# EAGLE design Adapter_board (EAGLE 8.2.0)
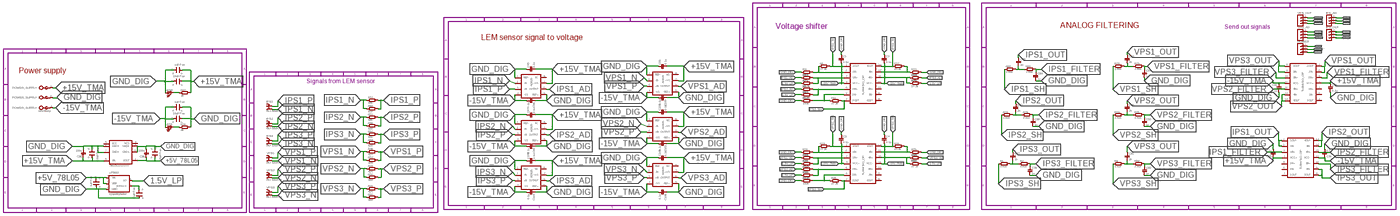
[diagram p0: schematic, sheet 1, overview]
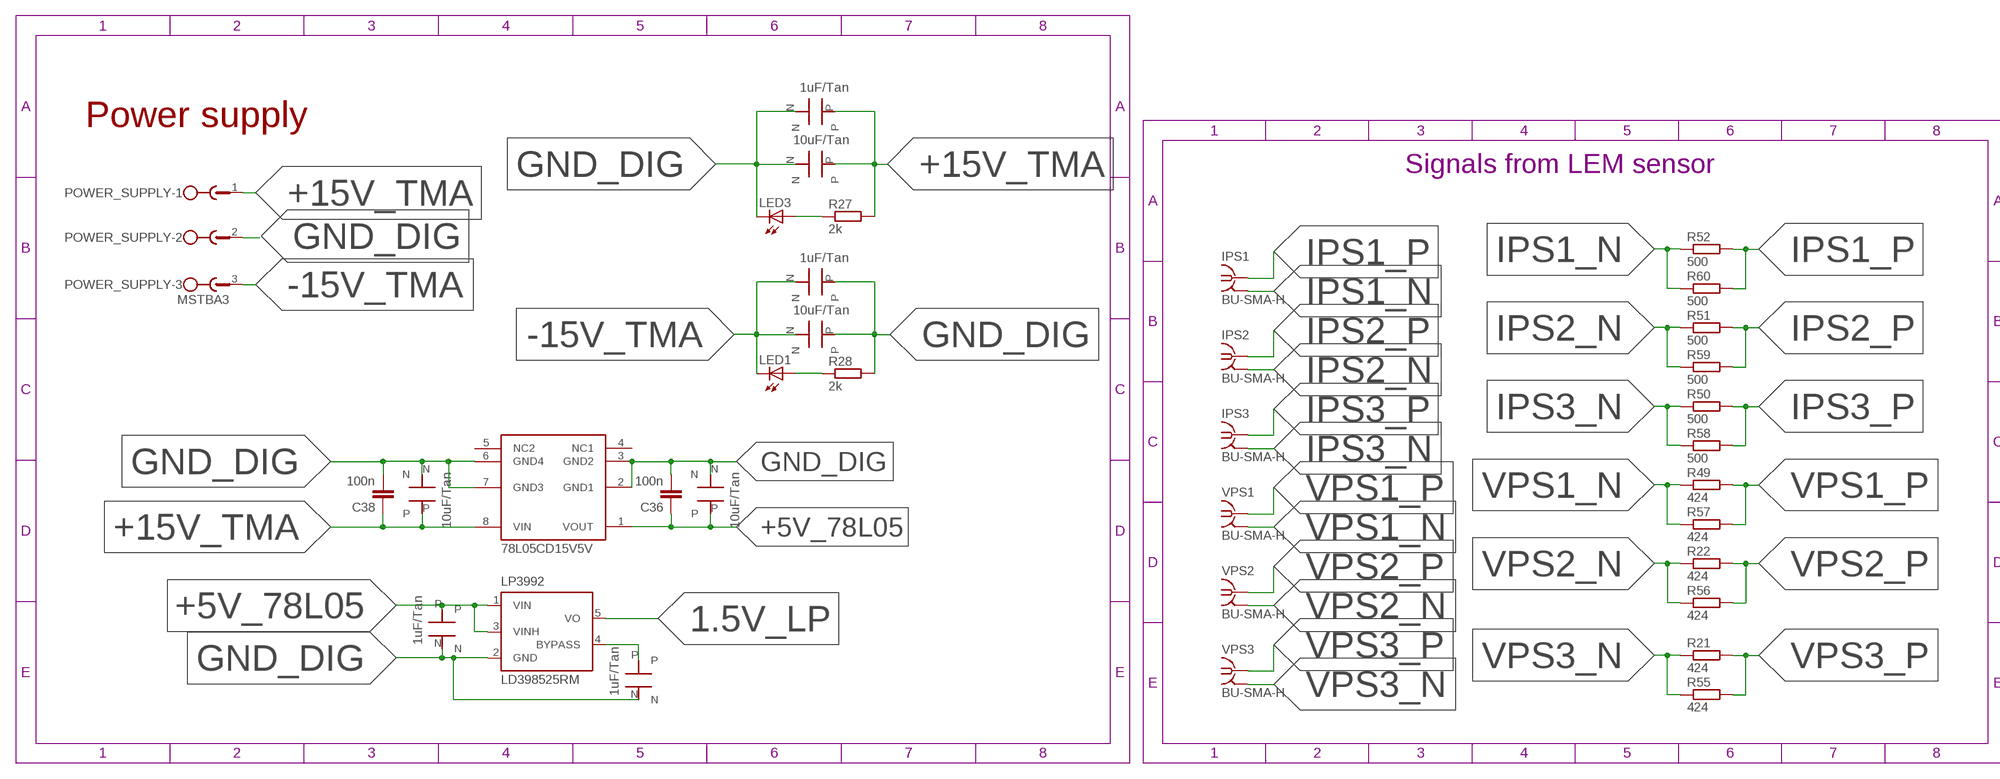
[diagram p1: schematic, sheet 1, part 1 of 4]
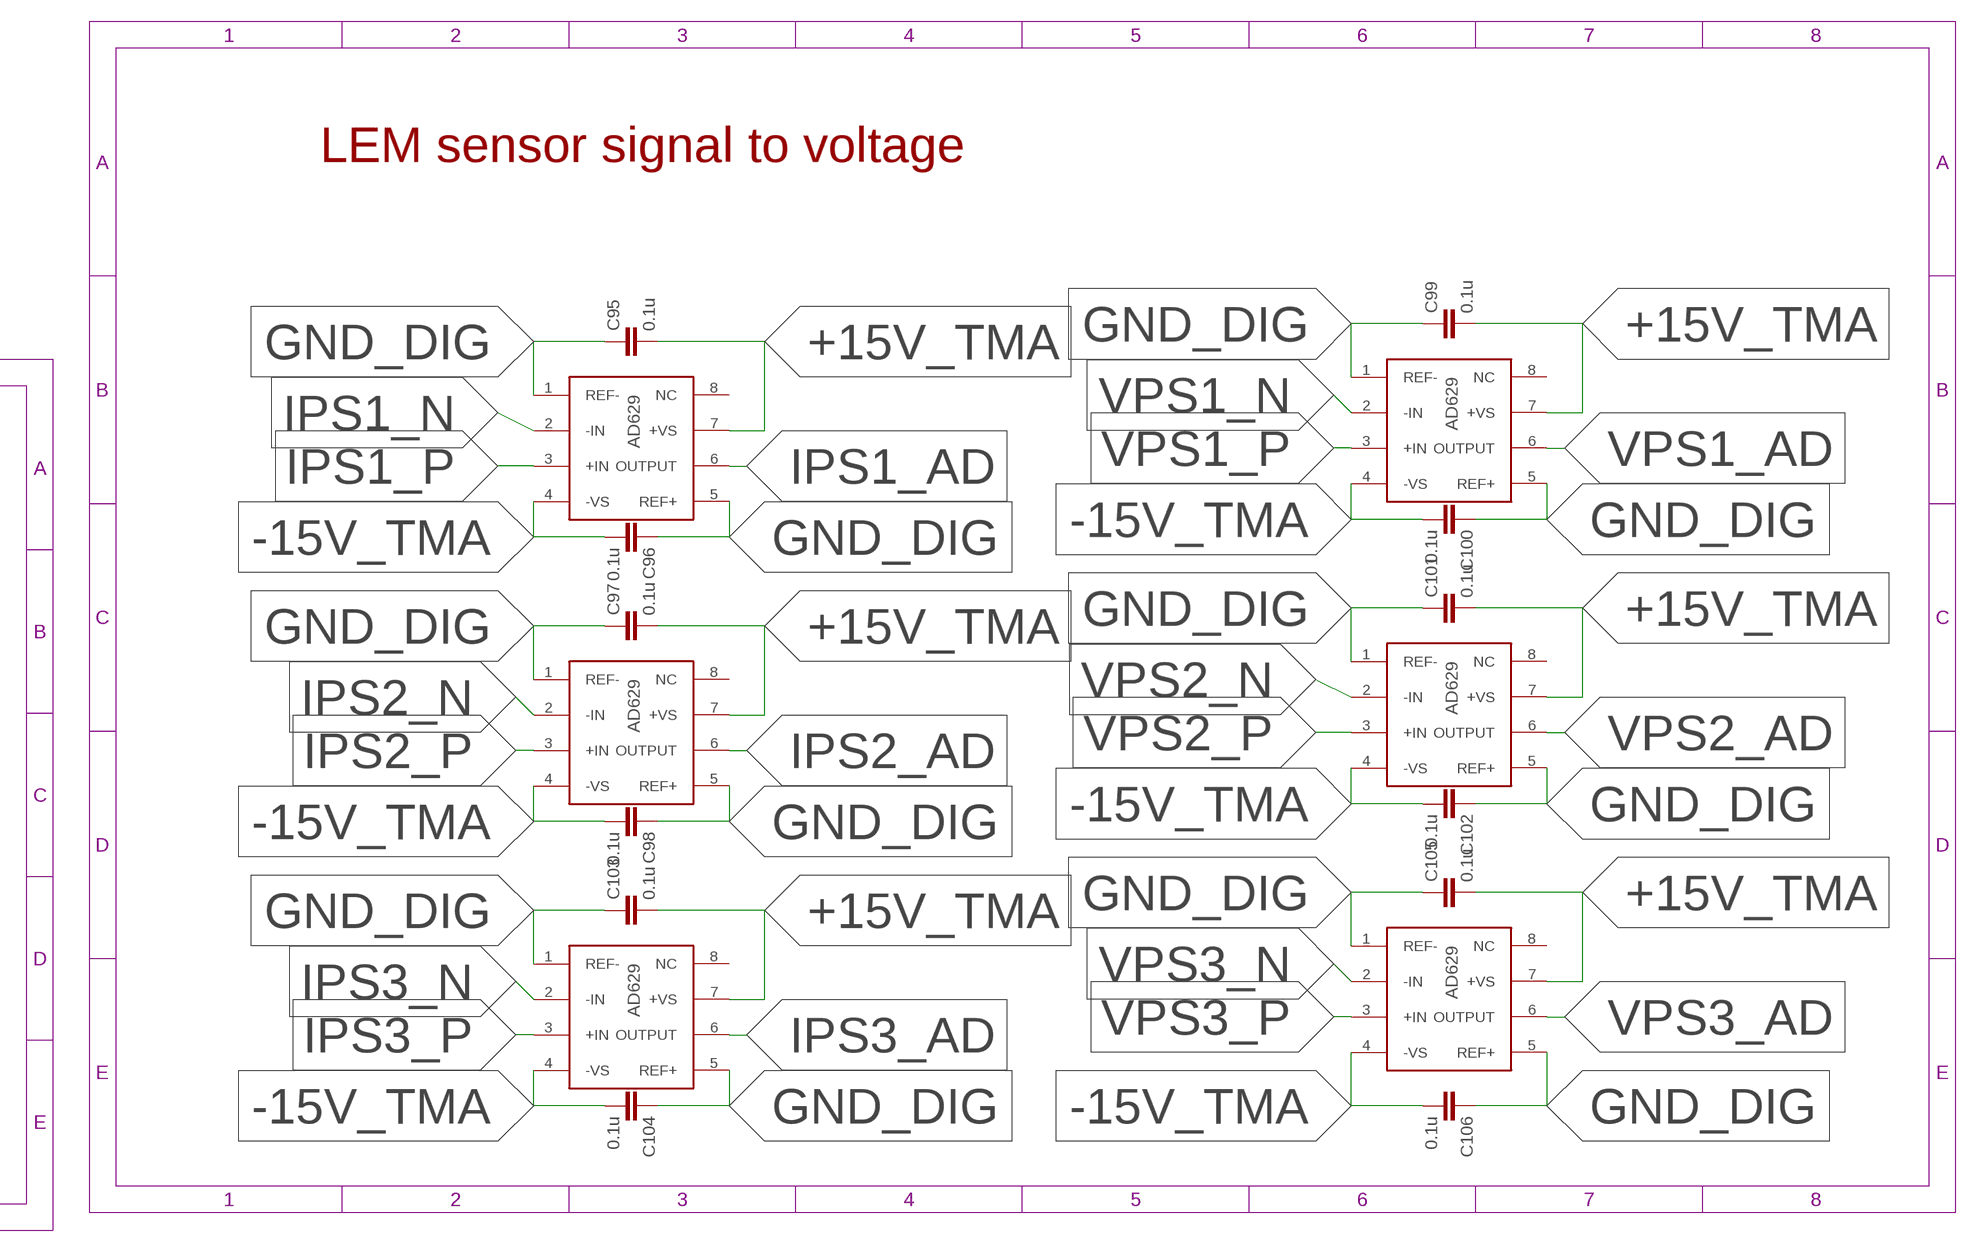
[diagram p2: schematic, sheet 1, part 2 of 4]
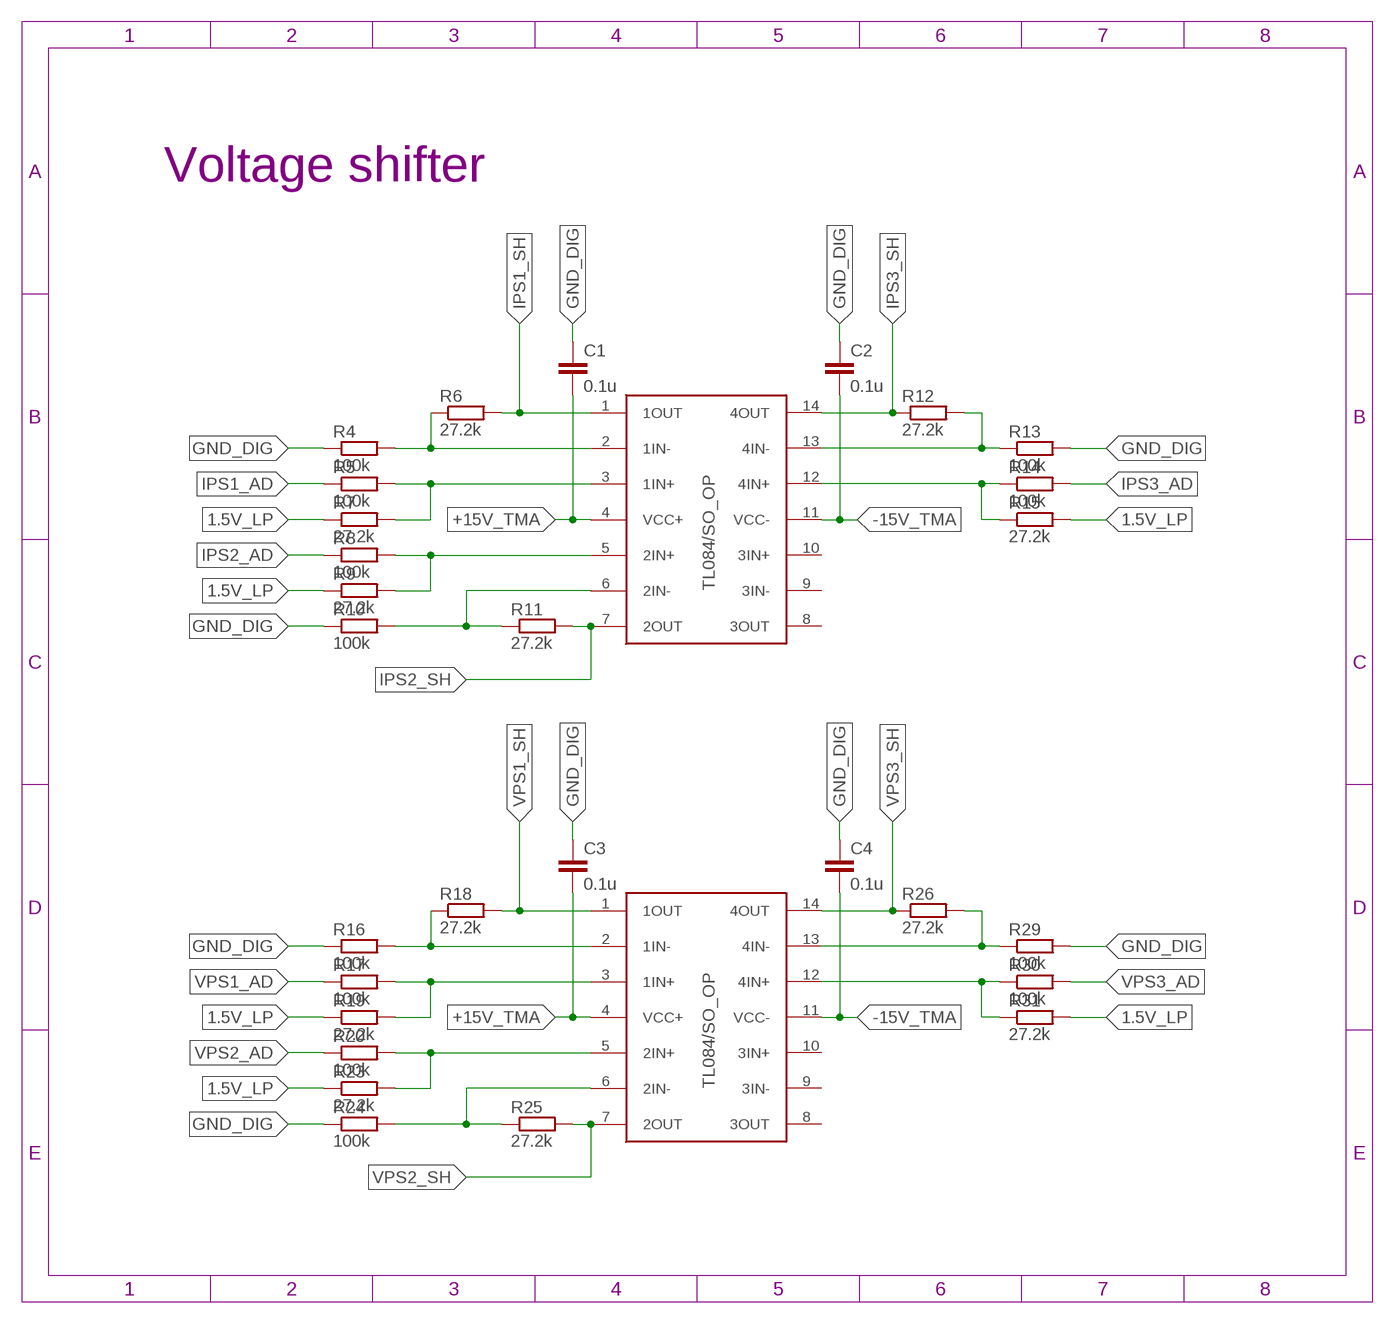
[diagram p3: schematic, sheet 1, part 3 of 4]
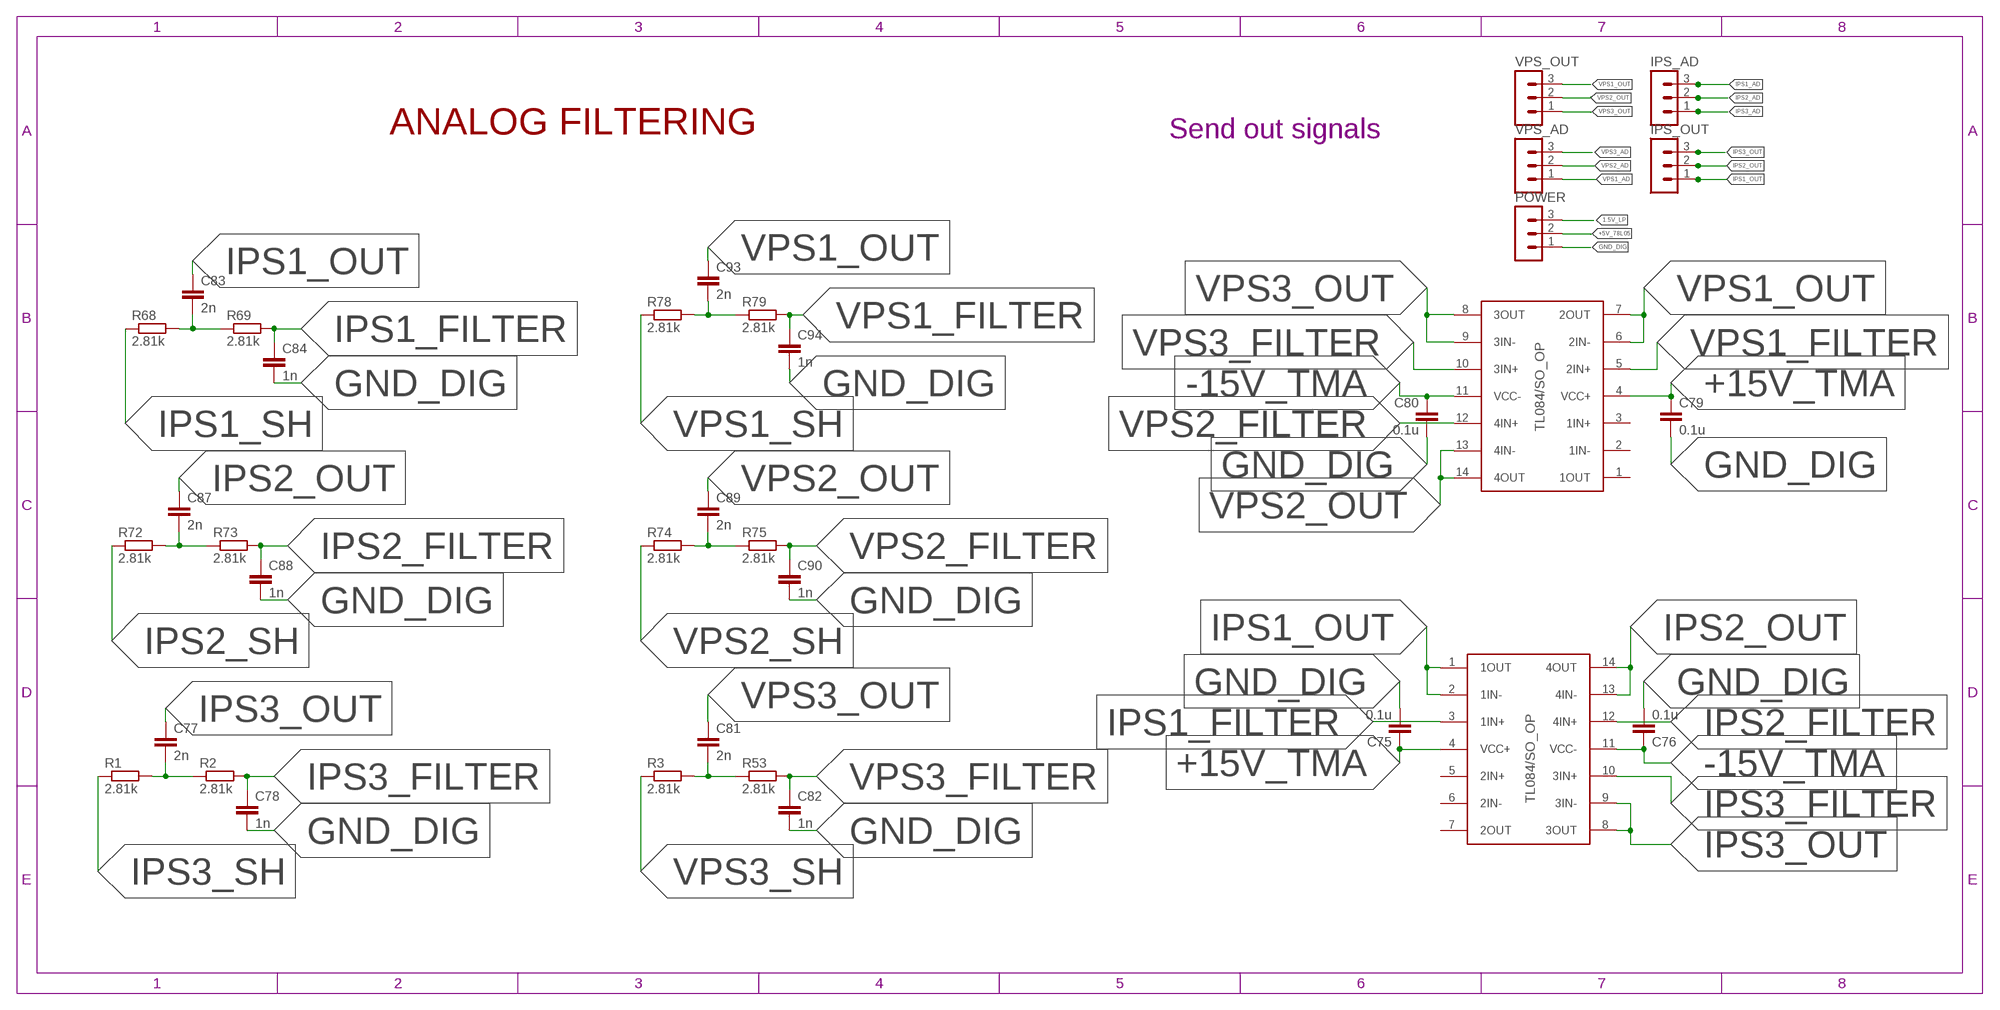
[diagram p4: schematic, sheet 1, part 4 of 4]

## Parts
78L05  78L05CD15V5VONLINE  [78L05CD15V5V_LIB]
C1  0.1u  C-EUC0805  [C0805]
C2  0.1u  C-EUC0805  [C0805]
C3  0.1u  C-EUC0805  [C0805]
C4  0.1u  C-EUC0805  [C0805]
C36  100n  C-EUC0805  [C0805]
C37  TANTALUM_C_10UF_KEM  [TANTALUM_C_10UF_KEM]
C38  100n  C-EUC0805  [C0805]
C75  0.1u  C-EUC0805  [C0805]
C76  0.1u  C-EUC0805  [C0805]
C77  2n  C-EUC0805  [C0805]
C78  1n  C-EUC0805  [C0805]
C79  0.1u  C-EUC0805  [C0805]
C80  0.1u  C-EUC0805  [C0805]
C81  2n  C-EUC0805  [C0805]
C82  1n  C-EUC0805  [C0805]
C83  2n  C-EUC0805  [C0805]
C84  1n  C-EUC0805  [C0805]
C87  2n  C-EUC0805  [C0805]
C88  1n  C-EUC0805  [C0805]
C89  2n  C-EUC0805  [C0805]
C90  1n  C-EUC0805  [C0805]
C93  2n  C-EUC0805  [C0805]
C94  1n  C-EUC0805  [C0805]
C95  0.1u  C-EUC0805  [C0805]
C96  0.1u  C-EUC0805  [C0805]
C97  0.1u  C-EUC0805  [C0805]
C98  0.1u  C-EUC0805  [C0805]
C99  0.1u  C-EUC0805  [C0805]
C100  0.1u  C-EUC0805  [C0805]
C101  0.1u  C-EUC0805  [C0805]
C102  0.1u  C-EUC0805  [C0805]
C103  0.1u  C-EUC0805  [C0805]
C104  0.1u  C-EUC0805  [C0805]
C105  0.1u  C-EUC0805  [C0805]
C106  0.1u  C-EUC0805  [C0805]
IPS1  BU-SMA-H  [BU-SMA-H]
IPS2  BU-SMA-H  [BU-SMA-H]
IPS3  BU-SMA-H  [BU-SMA-H]
IPS_AD  MA03-1  [MA03-1]
IPS_OUT  MA03-1  [MA03-1]
LED1  LEDCHIPLED_0805  [CHIPLED_0805]
LED3  LEDCHIPLED_0805  [CHIPLED_0805]
LP3992  LD398525RM  [SOT23-5L]
POWER  MA03-1  [MA03-1]
POWER_SUPPLY  MSTBA3  [MSTBA3]
R1  2.81k  R-EU_R0805  [R0805]
R2  2.81k  R-EU_R0805  [R0805]
R3  2.81k  R-EU_R0805  [R0805]
R4  100k  R-EU_R0805  [R0805]
R5  100k  R-EU_R0805  [R0805]
R6  27.2k  R-EU_R0805  [R0805]
R7  27.2k  R-EU_R0805  [R0805]
R8  100k  R-EU_R0805  [R0805]
R9  27.2k  R-EU_R0805  [R0805]
R10  100k  R-EU_R0805  [R0805]
R11  27.2k  R-EU_R0805  [R0805]
R12  27.2k  R-EU_R0805  [R0805]
R13  100k  R-EU_R0805  [R0805]
R14  100k  R-EU_R0805  [R0805]
R15  27.2k  R-EU_R0805  [R0805]
R16  100k  R-EU_R0805  [R0805]
R17  100k  R-EU_R0805  [R0805]
R18  27.2k  R-EU_R0805  [R0805]
R19  27.2k  R-EU_R0805  [R0805]
R20  100k  R-EU_R0805  [R0805]
R21  424  R-EU_R1206  [R1206]
R22  424  R-EU_R1206  [R1206]
R23  27.2k  R-EU_R0805  [R0805]
R24  100k  R-EU_R0805  [R0805]
R25  27.2k  R-EU_R0805  [R0805]
R26  27.2k  R-EU_R0805  [R0805]
R27  2k  R-EU_R0805  [R0805]
R28  2k  R-EU_R0805  [R0805]
R29  100k  R-EU_R0805  [R0805]
R30  100k  R-EU_R0805  [R0805]
R31  27.2k  R-EU_R0805  [R0805]
R49  424  R-EU_R1206  [R1206]
R50  500  R-EU_R1206  [R1206]
R51  500  R-EU_R1206  [R1206]
R52  500  R-EU_R1206  [R1206]
R53  2.81k  R-EU_R0805  [R0805]
R55  424  R-EU_R1206  [R1206]
R56  424  R-EU_R1206  [R1206]
R57  424  R-EU_R1206  [R1206]
R58  500  R-EU_R1206  [R1206]
R59  500  R-EU_R1206  [R1206]
R60  500  R-EU_R1206  [R1206]
R68  2.81k  R-EU_R0805  [R0805]
R69  2.81k  R-EU_R0805  [R0805]
R72  2.81k  R-EU_R0805  [R0805]
R73  2.81k  R-EU_R0805  [R0805]
R74  2.81k  R-EU_R0805  [R0805]
R75  2.81k  R-EU_R0805  [R0805]
R78  2.81k  R-EU_R0805  [R0805]
R79  2.81k  R-EU_R0805  [R0805]
U$1  TL084/SO_OPONLINE  [TL084/SO_OP_LIB]
U$2  TL084/SO_OPONLINE  [TL084/SO_OP_LIB]
U$3  TANTALUM_C_1UF_KEMTANTALUM_C_1UF_KEM  [TANTALUM_C_1UF_KEM]
U$4  TL084/SO_OPONLINE  [TL084/SO_OP_LIB]
U$5  TANTALUM_C_1UF_KEMTANTALUM_C_1UF_KEM  [TANTALUM_C_1UF_KEM]
U$6  TL084/SO_OPONLINE  [TL084/SO_OP_LIB]
U$10  TANTALUM_C_1UF_KEMTANTALUM_C_1UF_KEM  [TANTALUM_C_1UF_KEM]
U$11  TANTALUM_C_10UF_KEM  [TANTALUM_C_10UF_KEM]
U$12  TANTALUM_C_1UF_KEMTANTALUM_C_1UF_KEM  [TANTALUM_C_1UF_KEM]
U$14  TANTALUM_C_10UF_KEM  [TANTALUM_C_10UF_KEM]
U$24  AD629_DIFFAONLINE  [AD629_DIFFA_LIB]
U$27  AD629_DIFFAONLINE  [AD629_DIFFA_LIB]
U$28  AD629_DIFFAONLINE  [AD629_DIFFA_LIB]
U$29  AD629_DIFFAONLINE  [AD629_DIFFA_LIB]
U$30  AD629_DIFFAONLINE  [AD629_DIFFA_LIB]
U$31  AD629_DIFFAONLINE  [AD629_DIFFA_LIB]
U$66  TANTALUM_C_10UF_KEM  [TANTALUM_C_10UF_KEM]
VPS1  BU-SMA-H  [BU-SMA-H]
VPS2  BU-SMA-H  [BU-SMA-H]
VPS3  BU-SMA-H  [BU-SMA-H]
VPS_AD  MA03-1  [MA03-1]
VPS_OUT  MA03-1  [MA03-1]

## Nets
1.5V_LP: LP3992.5(VO) POWER.3 R7.1 R9.1 R15.2 R19.1 R23.1 R31.2
+5V_78L05: 78L05.1(VOUT) C36.1 C37.P LP3992.1(VIN) LP3992.3(VINH) POWER.2 U$3.P
+15V_TMA: 78L05.8(VIN) C1.2 C3.2 C38.1 C75.1 C79.1 C95.2 C97.2 C99.2 C101.2 C103.2 C105.2 POWER_SUPPLY.1 R27.2 U$1.4(VCC+) U$2.4(VCC+) U$4.4(VCC+) U$6.4(VCC+) U$10.P U$11.P U$24.7(+VS) U$27.7(+VS) U$28.7(+VS) U$29.7(+VS) U$30.7(+VS) U$31.7(+VS) U$66.P
-15V_TMA: C2.2 C4.2 C76.1 C80.1 C96.2 C98.2 C100.2 C102.2 C104.2 C106.2 LED1.C POWER_SUPPLY.3 U$1.11(VCC-) U$2.11(VCC-) U$4.11(VCC-) U$6.11(VCC-) U$12.N U$14.N U$24.4(-VS) U$27.4(-VS) U$28.4(-VS) U$29.4(-VS) U$30.4(-VS) U$31.4(-VS)
GND_DIG: 78L05.2(GND1) 78L05.3(GND2) 78L05.6(GND4) 78L05.7(GND3) C1.1 C2.1 C3.1 C4.1 C36.2 C37.N C38.2 C75.2 C76.2 C78.2 C79.2 C80.2 C82.2 C84.2 C88.2 C90.2 C94.2 C95.1 C96.1 C97.1 C98.1 C99.1 C100.1 C101.1 C102.1 C103.1 C104.1 C105.1 C106.1 LED3.C LP3992.2(GND) POWER.1 POWER_SUPPLY.2 R4.1 R10.1 R13.2 R16.1 R24.1 R28.2 R29.2 U$3.N U$5.N U$10.N U$11.N U$12.P U$14.P U$24.1(REF-) U$24.5(REF+) U$27.1(REF-) U$27.5(REF+) U$28.1(REF-) U$28.5(REF+) U$29.1(REF-) U$29.5(REF+) U$30.1(REF-) U$30.5(REF+) U$31.1(REF-) U$31.5(REF+) U$66.N
IPS1_AD: IPS_AD.3 R5.1 U$24.6(OUTPUT)
IPS1_FILTER: C84.1 R69.2 U$4.3(1IN+)
IPS1_N: IPS1.2 IPS1.3 IPS1.4 IPS1.5 R52.1 R60.1 U$24.2(-IN)
IPS1_OUT: C83.1 IPS_OUT.1 U$4.1(1OUT) U$4.2(1IN-)
IPS1_P: IPS1.1 R52.2 R60.2 U$24.3(+IN)
IPS1_SH: R6.2 R68.1 U$1.1(1OUT)
IPS2_AD: IPS_AD.2 R8.1 U$27.6(OUTPUT)
IPS2_FILTER: C88.1 R73.2 U$4.12(4IN+)
IPS2_N: IPS2.2 IPS2.3 IPS2.4 IPS2.5 R51.1 R59.1 U$27.2(-IN)
IPS2_OUT: C87.1 IPS_OUT.2 U$4.13(4IN-) U$4.14(4OUT)
IPS2_P: IPS2.1 R51.2 R59.2 U$27.3(+IN)
IPS2_SH: R11.2 R72.1 U$1.7(2OUT)
IPS3_AD: IPS_AD.1 R14.2 U$30.6(OUTPUT)
IPS3_FILTER: C78.1 R2.2 U$4.10(3IN+)
IPS3_N: IPS3.2 IPS3.3 IPS3.4 IPS3.5 R50.1 R58.1 U$30.2(-IN)
IPS3_OUT: C77.1 IPS_OUT.3 U$4.8(3OUT) U$4.9(3IN-)
IPS3_P: IPS3.1 R50.2 R58.2 U$30.3(+IN)
IPS3_SH: R1.1 R12.1 U$1.14(4OUT)
N$2: LP3992.4(BYPASS) U$5.P
N$3: R4.2 R6.1 U$1.2(1IN-)
N$4: R5.2 R7.2 U$1.3(1IN+)
N$5: R16.2 R18.1 U$2.2(1IN-)
N$6: R10.2 R11.1 U$1.6(2IN-)
N$7: R8.2 R9.2 U$1.5(2IN+)
N$8: R17.2 R19.2 U$2.3(1IN+)
N$9: C77.2 R1.2 R2.1
N$10: C81.2 R3.2 R53.1
N$11: C83.2 R68.2 R69.1
N$12: LED3.A R27.1
N$14: LED1.A R28.1
N$15: C87.2 R72.2 R73.1
N$16: R20.2 R23.2 U$2.5(2IN+)
N$17: C89.2 R74.2 R75.1
N$19: C93.2 R78.2 R79.1
N$20: R12.2 R13.1 U$1.13(4IN-)
N$21: R14.1 R15.1 U$1.12(4IN+)
N$22: R24.2 R25.1 U$2.6(2IN-)
N$23: R26.2 R29.1 U$2.13(4IN-)
N$24: R30.1 R31.1 U$2.12(4IN+)
VPS1_AD: R17.1 U$28.6(OUTPUT) VPS_AD.1
VPS1_FILTER: C94.1 R79.2 U$6.5(2IN+)
VPS1_N: R49.1 R57.1 U$28.2(-IN) VPS1.2 VPS1.3 VPS1.4 VPS1.5
VPS1_OUT: C93.1 U$6.6(2IN-) U$6.7(2OUT) VPS_OUT.3
VPS1_P: R49.2 R57.2 U$28.3(+IN) VPS1.1
VPS1_SH: R18.2 R78.1 U$2.1(1OUT)
VPS2_AD: R20.1 U$29.6(OUTPUT) VPS_AD.2
VPS2_FILTER: C90.1 R75.2 U$6.12(4IN+)
VPS2_N: R22.1 R56.1 U$29.2(-IN) VPS2.2 VPS2.3 VPS2.4 VPS2.5
VPS2_OUT: C89.1 U$6.13(4IN-) U$6.14(4OUT) VPS_OUT.2
VPS2_P: R22.2 R56.2 U$29.3(+IN) VPS2.1
VPS2_SH: R25.2 R74.1 U$2.7(2OUT)
VPS3_AD: R30.2 U$31.6(OUTPUT) VPS_AD.3
VPS3_FILTER: C82.1 R53.2 U$6.10(3IN+)
VPS3_N: R21.1 R55.1 U$31.2(-IN) VPS3.2 VPS3.3 VPS3.4 VPS3.5
VPS3_OUT: C81.1 U$6.8(3OUT) U$6.9(3IN-) VPS_OUT.1
VPS3_P: R21.2 R55.2 U$31.3(+IN) VPS3.1
VPS3_SH: R3.1 R26.1 U$2.14(4OUT)
Unconnected: 78L05.4(NC1) 78L05.5(NC2) U$1.8(3OUT) U$1.9(3IN-) U$1.10(3IN+) U$2.8(3OUT) U$2.9(3IN-) U$2.10(3IN+) U$4.5(2IN+) U$4.6(2IN-) U$4.7(2OUT) U$6.1(1OUT) U$6.2(1IN-) U$6.3(1IN+) U$24.8(NC) U$27.8(NC) U$28.8(NC) U$29.8(NC) U$30.8(NC) U$31.8(NC)

## Notes on the sheet
- Voltage shifter | ANALOG FILTERING | Send out signals
- LEM sensor signal to voltage
- Power supply
- Signals from LEM sensor

## Library data of the parts
78L05 = Submodule:78L05CD15V5V: 78L05CD 15 V- 5 V voltage regulator
C1-C4 C36 C38 C75-C84 C87-C90 C93-C106 = rcl:C-EU: CAPACITOR, European symbol
C37 U$11 U$14 U$66 = Submodule:TANTALUM_C_10UF_KEM
IPS1-IPS3 VPS1-VPS3 = con-coax:BU-SMA-H: FEMALE SMA CONNECTOR Radiall; OC_FARNELL: unknown; OC_NEWARK: unknown
IPS_AD IPS_OUT POWER VPS_AD VPS_OUT = con-lstb:MA03-1: PIN HEADER; OC_FARNELL: unknown; OC_NEWARK: unknown
LED1 LED3 = led:LED: LED OSRAM: - CHIPLED LG R971, LG N971, LY N971, LG Q971, LY Q971, LO R971, LY R971 LH N974, LH R974 LS Q976, LO Q976, LY Q976 LO Q996 - Hyper CHIPLED LW Q18S LB Q993, LB Q99A, LB R99A - SideLED LS A670, LO A670, LY A670, LG A670, LP A670 LB A673, LV A673, LT A673, LW A673 LH A674 LY A675 LS A676, LA A676, LO A676, LY A676, LW A676 LS A679, LY A679, LG A679 - Hyper Micro SIDELED® LS Y876, LA Y876, LO Y876, LY Y876 LT Y87S - SmartLED LW L88C, LW L88S LB L89C, LB L89S, LG L890 LS L89K, LO L89K, LY L89K LS L896, LA L896, LO L896, LY L896 - TOPLED LS T670, LO T670, LY T670, LG T670, LP T670 LSG T670, LSP T670, LSY T670, LOP T670, LYG T670 LG T671, LOG T671, LSG T671 LB T673, LV T673, LT T673, LW T673 LH T674 LS T676, LA T676, LO T676, LY T676, LB T676, LH T676, LSB T676, LW T676 LB T67C, LV T67C, LT T67C, LS T67K, LO T67K, LY T67K, LW E67C LS E67B, LA E67B, LO E67B, LY E67B, LB E67C, LV E67C, LT E67C LW T67C LS T679, LY T679, LG T679 LS T770, LO T770, LY T770, LG T770, LP T770 LB T773, LV T773, LT T773, LW T773 LH T774 LS E675, LA E675, LY E675, LS T675 LS T776, LA T776, LO T776, LY T776, LB T776 LHGB T686 LT T68C, LB T68C - Hyper Mini TOPLED® LB M676 - Mini TOPLED Santana® LG M470 LS M47K, LO M47K, LY M47K Source: http://www.osram.convergy.de LUXEON: - LUMILED® LXK2-PW12-R00, LXK2-PW12-S00, LXK2-PW14-U00, LXK2-PW14-V00 LXK2-PM12-R00, LXK2-PM12-S00, LXK2-PM14-U00 LXK2-PE12-Q00, LXK2-PE12-R00, LXK2-PE12-S00, LXK2-PE14-T00, LXK2-PE14-U00 LXK2-PB12-K00, LXK2-PB12-L00, LXK2-PB12-M00, LXK2-PB14-N00, LXK2-PB14-P00, LXK2-PB14-Q00 LXK2-PR12-L00, LXK2-PR12-M00, LXK2-PR14-Q00, LXK2-PR14-R00 LXK2-PD12-Q00, LXK2-PD12-R00, LXK2-PD12-S00 LXK2-PH12-R00, LXK2-PH12-S00 LXK2-PL12-P00, LXK2-PL12-Q00, LXK2-PL12-R00 Source: www.luxeon.com KINGBRIGHT: KA-3528ASYC Source: www.kingbright.com
LP3992 = st-microelectronics:LD3985: Ultra low drop and low noise BiCMOS voltage regulators Source: www.st.com LD3985.pdf
POWER_SUPPLY = con-phoenix-508:MSTBA3: PHOENIX; MF: FARNELL; MPN: 1757255; OC_FARNELL: 3705183; OC_NEWARK: 71C4162
R1-R31 R49-R53 R55-R60 R68 R69 R72-R75 R78 R79 = rcl:R-EU_: RESISTOR, European symbol
U$1 U$2 U$4 U$6 = Submodule:TL084/SO_OP
U$3 U$5 U$10 U$12 = Submodule:TANTALUM_C_1UF_KEM
U$24 U$27-U$31 = Submodule:AD629_DIFFA

## Board
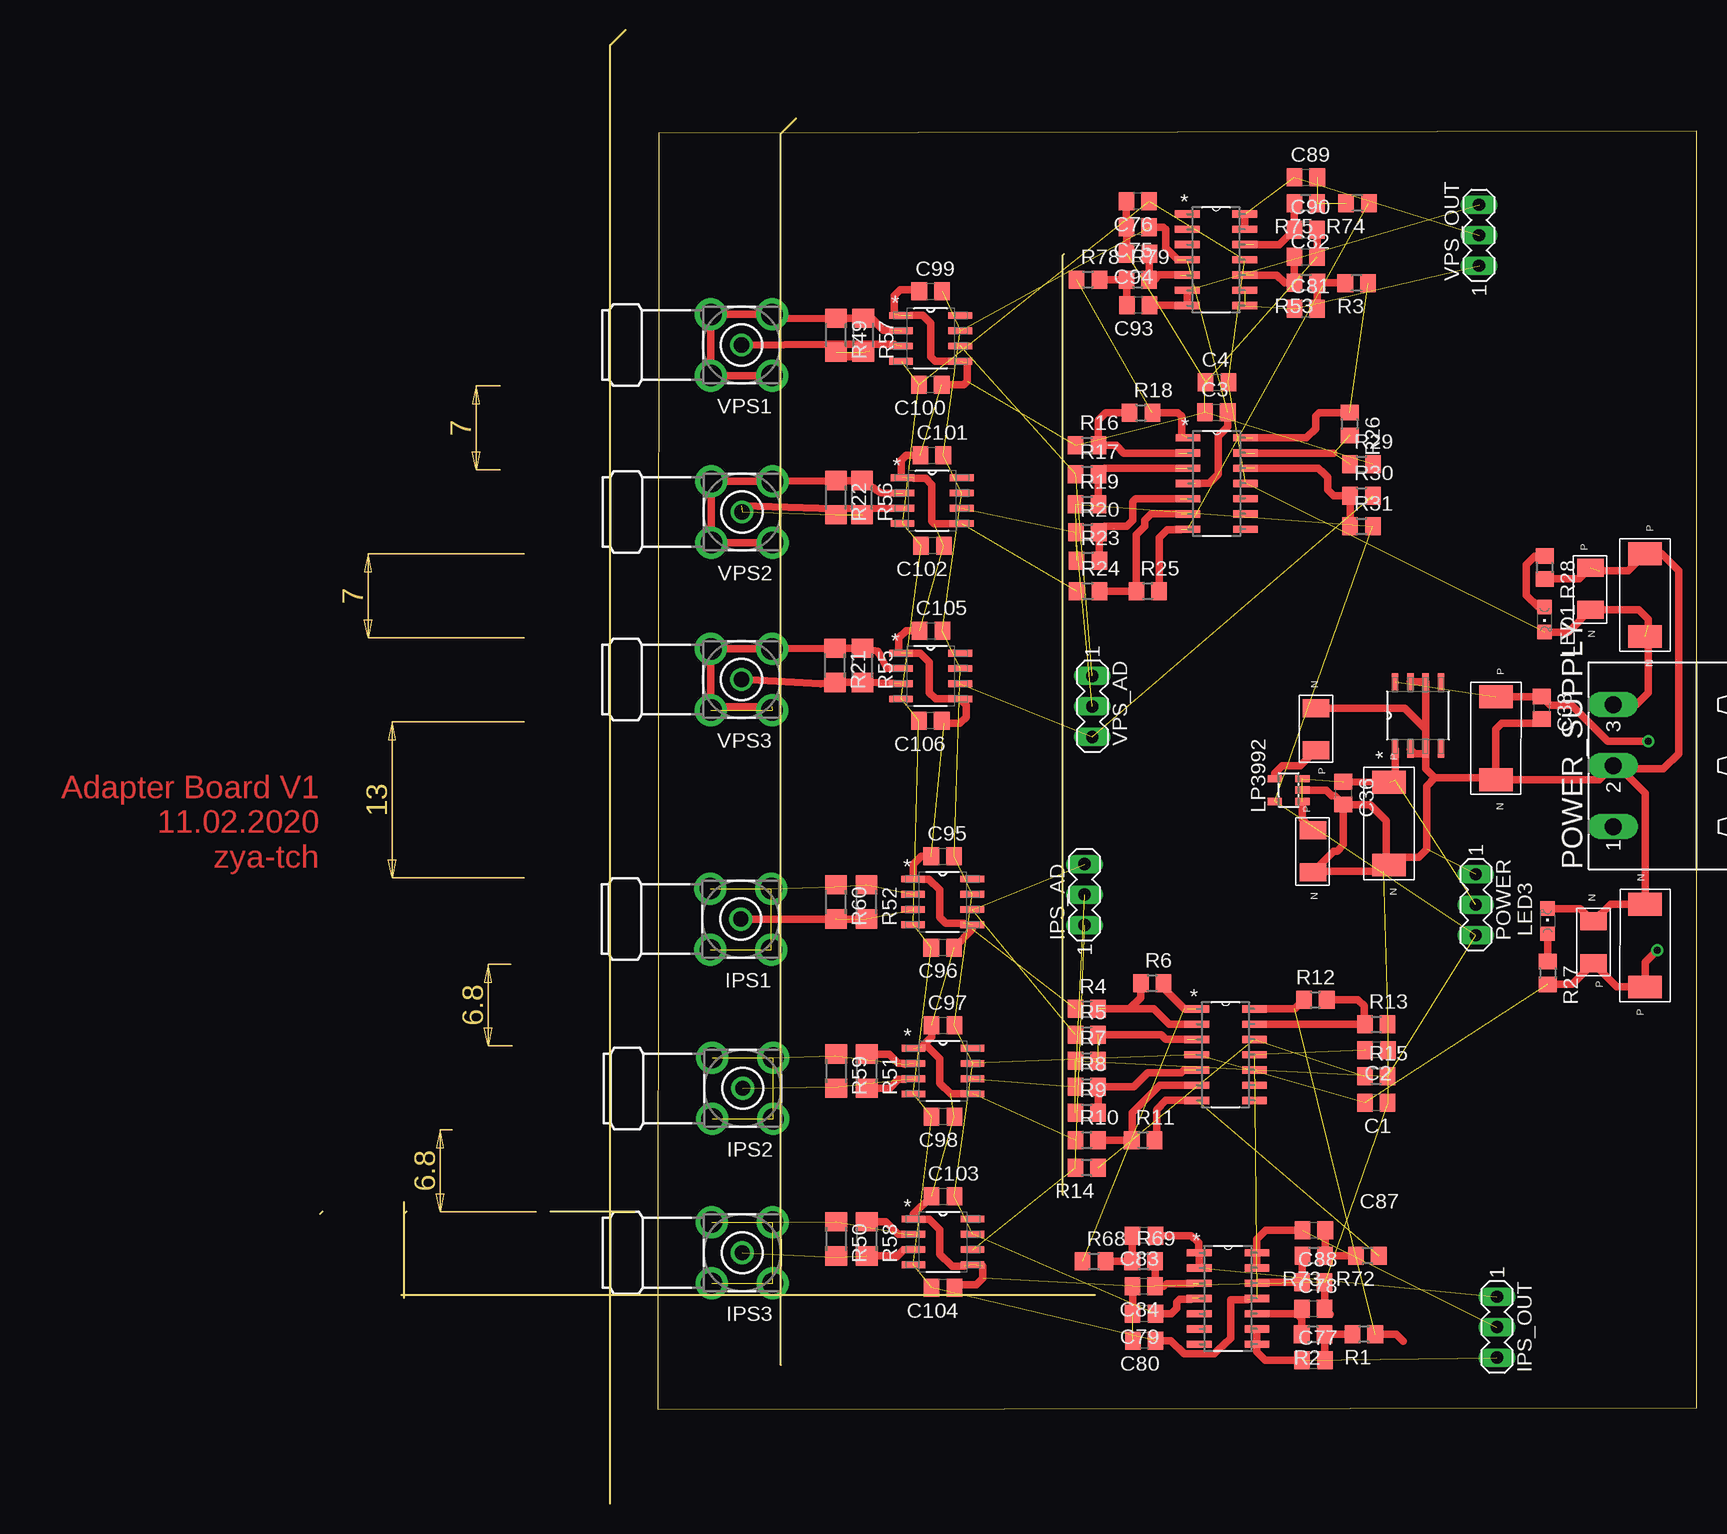
[diagram p5: board, top side]
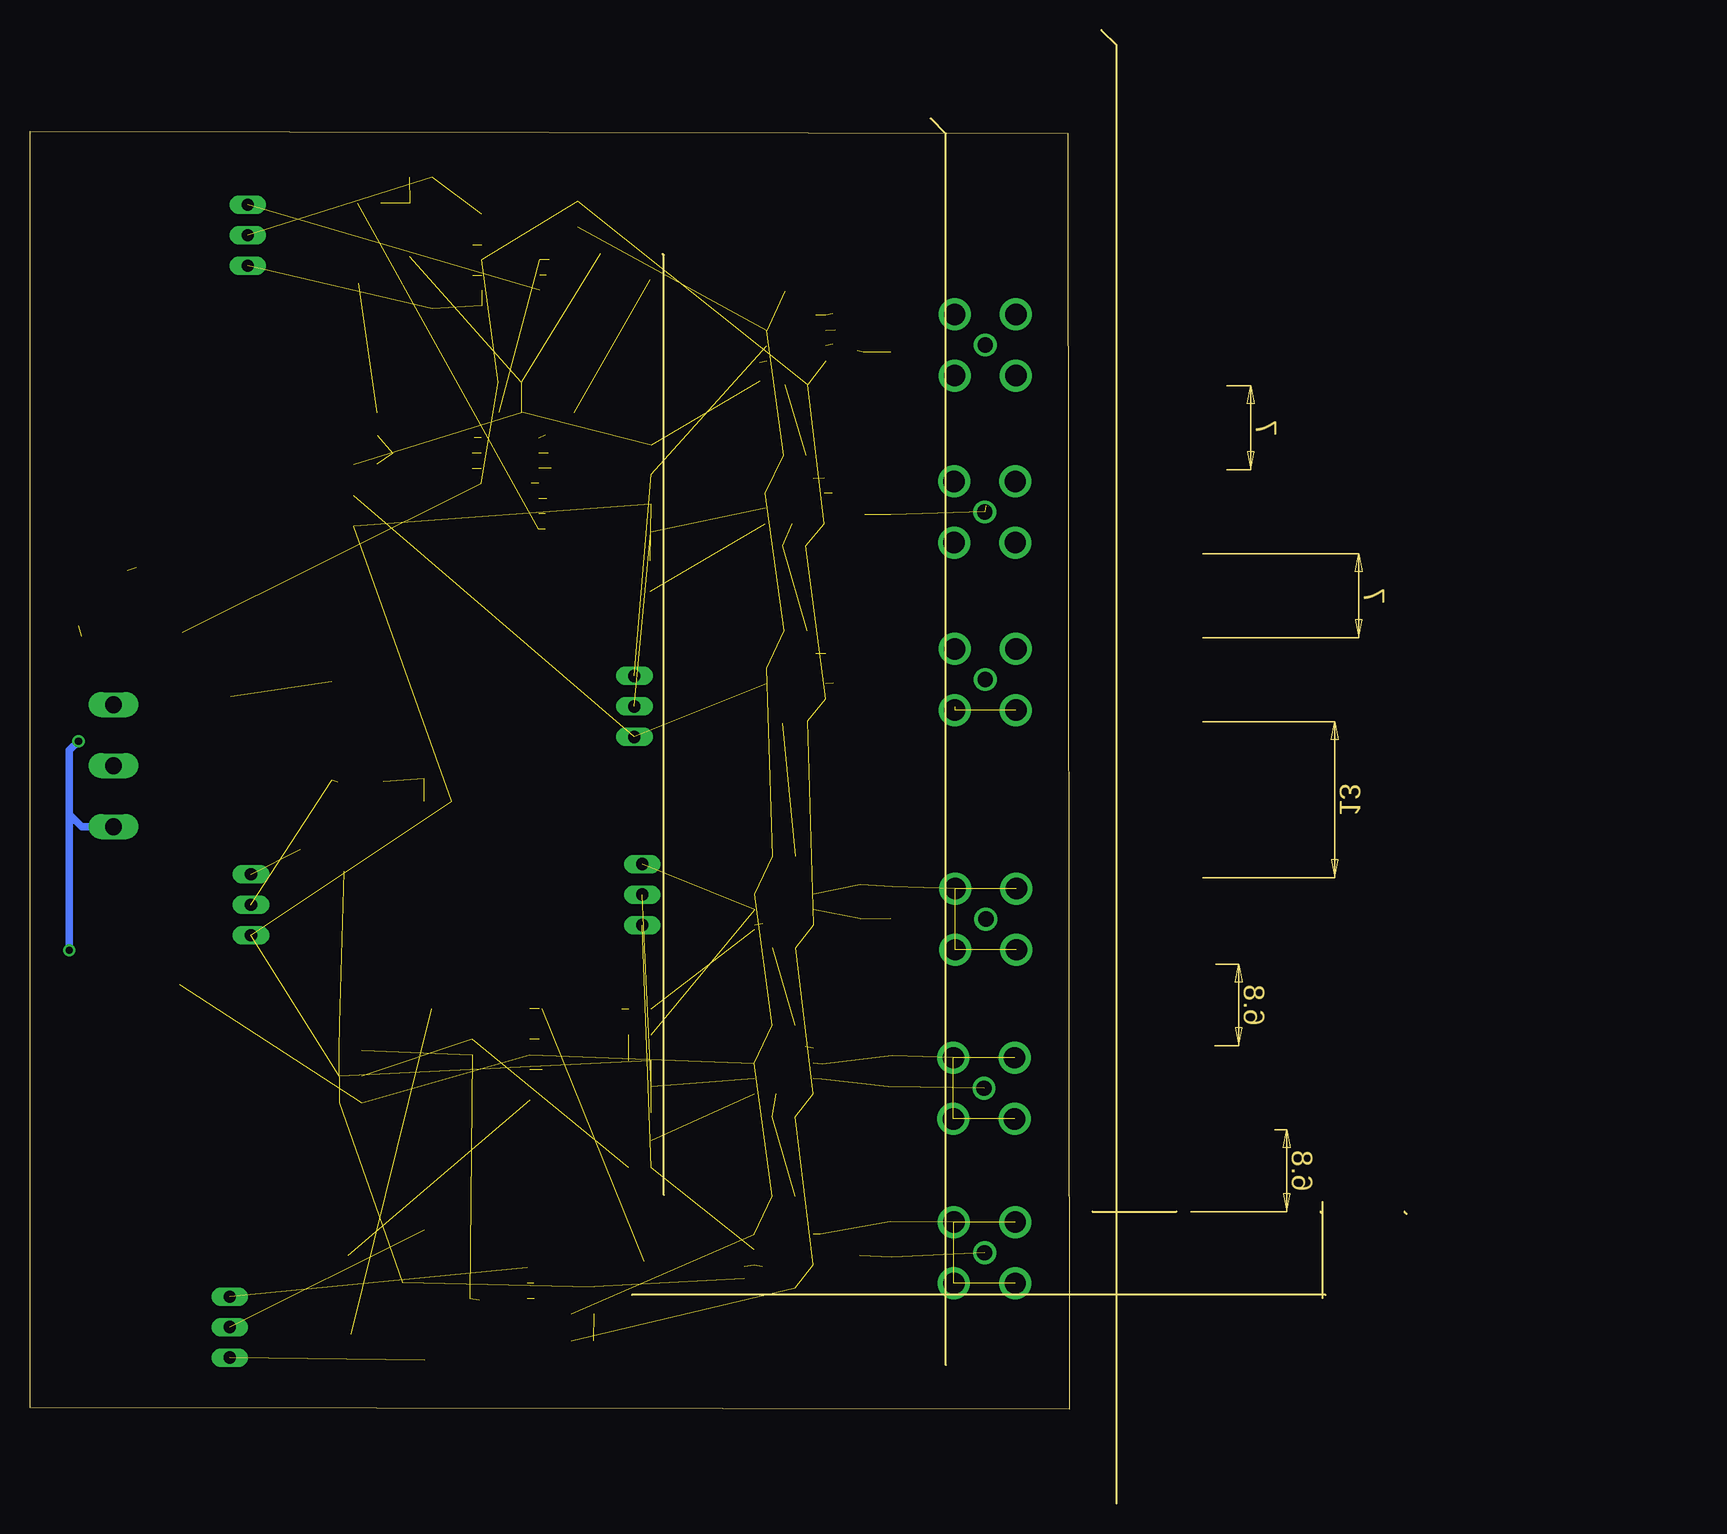
[diagram p6: board, bottom side, seen from below]

Size 114.72 x 122.81 mm. Coordinates in mm from the lower left corner, seen from the top.
Outline: 38.4,11.56 38.4,114.17 39.67,115.44
Outline: 24.17,0 24.17,121.54 25.44,122.81
Outline: 6.77,17.4 64.56,17.4
Outline: 7.2,24.34 7,24.14
Outline: 7,17.14 7,25.14
Outline: 0.2,24.34 0,24.14
Outline: 26.2,24.34 19.2,24.34
Outline: 61.9,25.74 61.9,104.04 62,104.14
Outline: 28.13,7.89 114.72,8.02 114.72,114.35 28.23,114.23 28.13,7.89
Copper layers (1*16): Top 0.035mm / dielectric 1.5mm / Bottom 0.035mm
Design rules "default *": minimum track width 10mil, minimum drill 24mil, track to track 8mil, track to pad 8mil, pad to pad 8mil, via to via 8mil, smd to smd 8mil, copper to edge 40mil, drill to drill 8mil, minimum pad ring 10mil, minimum via ring 8mil, stop-mask expansion 4mil, vias tented up to drill 0mil, thermal gap 10mil

### Footprints (pad centres in the part's own frame; a part is rotated, then mirrored left to right if it is on the bottom)
78L05CD15V5V_LIB = smd 1.422 x 0.533: 1 -2.927,1.787; 2 -2.927,0.517; 3 -2.927,-0.753; 4 -2.927,-2.023; 5 2.661,-2.023; 6 2.661,-0.753; 7 2.661,0.517; 8 2.661,1.787
C0805 = smd 1.3 x 1.5: 1 -0.95,0; 2 0.95,0
TANTALUM_C_10UF_KEM = smd 1.9 x 2.8: N 3.45,0; P -3.45,0
BU-SMA-H = drill 1.27: 1 0,0 | drill 1.778: 2 -2.55,2.55; 3 2.55,2.55; 4 2.55,-2.55; 5 -2.55,-2.55
MA03-1 = drill 1.016 long: 1 -2.54,0; 2 0,0; 3 2.54,0
CHIPLED_0805 = smd 1.2 x 1.2: A 0,-1.05; C 0,1.05
SOT23-5L = smd 0.6 x 1.2: 1 -0.95,-1.15; 2 0,-1.15; 3 0.95,-1.15; 4 0.95,1.15; 5 -0.95,1.15
MSTBA3 = drill 1.397 long: 1 -5.08,5.08; 2 0,5.08; 3 5.08,5.08
R0805 = smd 1.3 x 1.5: 1 -0.95,0; 2 0.95,0
R1206 = smd 1.6 x 1.803: 1 -1.422,0; 2 1.422,0
TL084/SO_OP_LIB = smd 2.057 x 0.61: 1 -2.261,3.81; 2 -2.261,2.54; 3 -2.261,1.27; 4 -2.261,0; 5 -2.261,-1.27; 6 -2.261,-2.54; 7 -2.261,-3.81; 8 2.54,-3.81; 9 2.54,-2.54; 10 2.54,-1.27; 11 2.54,0; 12 2.54,1.27; 13 2.54,2.54; 14 2.54,3.81
TANTALUM_C_1UF_KEM = smd 1.5 x 2.2: N 1.75,0; P -1.75,0
AD629_DIFFA_LIB = smd 1.981 x 0.559: 1 -2.464,1.905; 2 -2.464,0.635; 3 -2.464,-0.635; 4 -2.464,-1.905; 5 2.464,-1.905; 6 2.464,-0.635; 7 2.464,0.635; 8 2.464,1.905

### Placement (x,y rotation side)
78L05  91.37,65.82 90 top
C1  88.02,33.41 180 top
C2  88.04,37.8 180 top
C3  74.69,90.96 0 top
C4  74.74,93.45 0 top
C36  85.28,59.21 270 top
C37  89.09,56.67 270 top
C38  101.79,66.33 270 top
C75  68.14,106.39 180 top
C76  68.14,108.54 180 top
C77  82.78,11.95 0 top
C78  82.76,16.26 0 top
C79  68.67,15.83 180 top
C80  68.68,13.6 180 top
C81  82.14,99.58 0 top
C82  82.14,103.91 0 top
C83  68.65,22.35 180 top
C84  68.64,18.11 180 top
C87  82.81,22.81 0 top
C88  82.76,18.47 0 top
C89  82.15,110.53 0 top
C90  82.14,106.17 0 top
C93  68.18,99.86 180 top
C94  68.15,104.17 180 top
C95  51.88,53.96 0 top
C96  51.88,46.34 180 top
C97  51.91,39.86 0 top
C98  51.91,32.24 180 top
C99  50.88,101.02 0 top
C100  50.85,93.25 180 top
C101  50.98,87.37 0 top
C102  51.03,79.83 180 top
C103  51.91,25.63 0 top
C104  51.91,18.01 180 top
C105  50.91,72.75 0 top
C106  50.86,65.24 180 top
IPS1  35.06,48.72 180 top
IPS2  35.22,34.62 180 top
IPS3  35.17,20.92 180 top
IPS_AD  63.7,50.76 90 top
IPS_OUT  98.07,14.72 270 top
LED1  102.04,73.69 180 top
LED3  102.3,48.55 0 top
LP3992  80.7,59.47 90 top
POWER  96.31,49.91 270 top
POWER_SUPPLY  112.84,61.5 90 top
R1  86.98,14.13 180 top
R2  82.75,14.11 180 top
R3  86.38,101.72 180 top
R4  63.88,41.23 0 top
R5  63.88,39.07 0 top
R6  69.35,43.39 0 top
R7  63.88,36.91 0 top
R8  63.88,34.75 0 top
R9  63.88,32.59 0 top
R10  63.88,30.3 0 top
R11  68.58,30.3 0 top
R12  82.94,41.99 0 top
R13  88.02,39.96 0 top
R14  63.88,27.99 180 top
R15  88.02,35.64 0 top
R16  63.92,88.19 0 top
R17  63.92,85.78 0 top
R18  68.41,90.91 0 top
R19  63.92,83.29 0 top
R20  63.94,80.95 0 top
R21  42.91,69.86 270 top
R22  42.98,83.84 270 top
R23  63.99,78.59 0 top
R24  63.99,76.05 0 top
R25  68.97,76.05 0 top
R26  85.79,89.97 270 top
R27  102.3,44.23 270 top
R28  102.04,78.01 270 top
R29  86.78,86.62 0 top
R30  86.78,84 0 top
R31  86.78,81.46 0 top
R49  43.01,97.37 270 top
R50  43.02,22.07 270 top
R51  45.56,36.05 270 top
R52  45.53,50.15 270 top
R53  82.15,101.74 180 top
R55  45.19,69.86 270 top
R56  45.16,83.84 270 top
R57  45.27,97.37 270 top
R58  45.56,22.07 270 top
R59  43.02,36.05 270 top
R60  42.99,50.15 270 top
R68  64.49,20.2 0 top
R69  68.63,20.21 0 top
R72  87.27,20.67 180 top
R73  82.8,20.66 180 top
R74  86.45,108.38 180 top
R75  82.14,108.38 180 top
R78  63.99,102.01 0 top
R79  68.14,102.01 0 top
U$1  75.31,37.42 0 top
U$2  74.58,85.02 0 top
U$3  82.74,54.39 270 top
U$4  75.53,17.1 0 top
U$5  82.99,64.55 90 top
U$6  74.52,103.66 0 top
U$10  106.11,46.77 90 top
U$11  110.42,46.51 90 top
U$12  105.85,76.23 270 top
U$14  110.42,75.72 270 top
U$24  51.88,50.15 0 top
U$27  51.91,36.05 0 top
U$28  50.88,97.11 0 top
U$29  51,83.59 0 top
U$30  51.91,21.82 0 top
U$31  50.88,68.97 0 top
U$66  97.98,63.79 270 top
VPS1  35.12,96.56 180 top
VPS2  35.16,82.65 180 top
VPS3  35.12,68.69 180 top
VPS_AD  64.35,66.44 270 top
VPS_OUT  96.58,105.7 90 top

### Tracks (layer width: path | path; a pad name or v marks a point on that pad's centre or on a via)
1.5V_LP  (7 unrouted)
+5V_78L05  (4 unrouted)
  Top 0.61: 78L05.1 89.59,60.28 | LP3992.1 81.85,57.02 U$3.P | C37.P C36.1
+15V_TMA  (via drill 0.6)  (21 unrouted)
  Top 0.61: R27.2 104.36,43.28 U$10.P 108.06,43.06 U$11.P 110.42,45.12 v111.44,46.13 | U$66.P 101.75,67.24 C38.1 102.53,66.53 104.3,66.53 107.31,63.53 v110.68,63.53 | C79.1 70.94,15.83 71.38,16.28 71.38,16.77 71.64,17.03 72.59,17.03 72.68,17.12 | C75.1 70.26,106.39 70.45,106.2 70.45,104.67 71.47,103.66 | C3.2 75.64,89.75 74.84,88.96 74.84,85.78 74.08,85.02 72.93,85.02
  Bottom 0.61: 111.44,57.44 110.42,56.42 POWER_SUPPLY.1 | v110.68,63.53 111.44,62.77 111.44,57.44 | v111.44,46.13 111.44,57.44
-15V_TMA  (21 unrouted)
  Top 0.61: POWER_SUPPLY.3 109.66,66.58 110.68,67.6 110.68,72.02 U$14.N | LED1.C 104.01,72.64 U$12.N 109.89,74.48 110.68,73.69 110.68,73.18 | C80.1 70.91,13.6 72.03,12.48 74.5,12.48 74.8,12.78 75.9,13.79 75.91,16.98 77.3,16.98
  Bottom 0.61: 107.12,66.58 POWER_SUPPLY.3
GND_DIG  (34 unrouted)
  Top 0.61: LED3.C 105.03,49.6 U$10.N 107.55,49.96 U$11.N 110.42,59.21 108.39,61.25 | U$66.N 97.83,60.48 92.9,60.48 | 92.9,60.48 92.13,61.25 92.13,62.52 | 92.13,62.52 78L05.3 92.13,64.55 | 78L05.2 91.23,62.52 92.13,62.52 | C37.N 89.74,53.88 91.55,53.88 92.21,54.54 92.21,59.8 92.9,60.48 | C104.1 53.11,18.26 54.7,18.26 55.21,18.77 55.21,19.79 | C95.1 50.1,53.96 49.41,53.28 U$24.1 50.74,52.06 51.62,51.17 51.62,48.88 52.13,48.37 53.66,48.37 | C37.N 88.58,52.72 83.1,52.72 | C37.N 88.83,53.48 88.83,56.93 87.5,58.26 C36.2 | C36.2 84.53,59.01 84.32,59.01 83.85,59.47 LP3992.2 | U$3.N 84.49,54.39 84.77,54.39 85.28,54.9 C36.2 | 53.68,19.79 52.67,19.79 51.65,20.8 51.65,22.83 50.76,23.72 U$30.1 49.44,24.11 C103.1 | U$66.N 106.59,60.34 POWER_SUPPLY.2 108.14,61.5 108.39,61.25 | R28.2 104.93,77.06 U$12.P | 106.61,77.76 109,77.76 U$14.P 111.8,79.17 113.22,77.76 113.22,62.52 111.95,61.25 108.39,61.25 | C38.2 101.47,65.06 98.48,65.06 97.98,64.55 U$66.N | 92.13,64.55 78L05.6 78L05.7 | U$5.N 90.38,66.3 92.13,64.55 | C96.1 54.34,47.86 U$24.5 | C97.1 50.96,38.91 50.13,38.08 50.64,38.08 51.65,37.07 51.65,35.04 52.54,34.15 U$27.5 | U$31.1 48.24,71.05 48.24,72.15 48.85,72.76 C105.1 | 49.25,70.88 50.02,70.88 50.78,70.11 50.78,67.57 51.29,67.06 U$31.5 53.34,67.04 53.83,66.56 53.83,65.54 53.32,65.03 52.01,65.03 C106.1 | U$29.5 51.18,81.68 50.98,81.89 50.98,84.93 50.47,85.44 49.45,85.44 | U$28.5 51.26,95.21 50.88,95.59 50.88,98.38 50.22,99.04 49.25,99.04 | 73.74,93.4 C4.1 | C100.1 53.62,93.25 53.93,93.56 53.93,95.08 | C99.1 49.78,101.18 48.34,101.18 47.83,100.67 47.83,99.15 | 84.17,15.8 C78.2 C88.2 | C79.2 67.72,18.08 C84.2
  Top 0.61: C94.2 67.2,106.38 C75.2 C76.2 | C101.1 48.84,87.37 48.44,86.97 48.44,85.59 U$29.1 | C90.2 C82.2
  pour Bottom (isolate 0.406): 118.41,-0.63 arc90 119.3,0.25
IPS1_AD  (2 unrouted)
IPS1_FILTER  (1 unrouted)
  Top 0.61: R69.2 69.58,18.12 C84.1 70.32,18.11 70.55,18.34 72.71,18.34 72.76,18.39
IPS1_N  (6 unrouted)
  Top 0.61: 42.85,51.43 R60.1
IPS1_OUT  (1 unrouted)
  Top 0.61: U$4.2 U$4.1 73.24,20.94 73.24,21.73 72.62,22.35 C83.1
IPS1_P  (2 unrouted)
  Top 0.61: IPS1.1 45.52,48.72 R52.2
IPS1_SH  (2 unrouted)
  Top 0.61: R6.2 70.3,42.94 72.01,41.23 72.27,41.23
IPS2_AD  (2 unrouted)
IPS2_FILTER
  Top 0.61: U$4.12 78.17,18.48 C88.1 81.85,18.51 R73.2
IPS2_N  (6 unrouted)
  Top 0.61: 42.87,37.33 R59.1 | R51.1 47.41,37.47 48.2,36.69 48.66,36.69 48.71,36.64
IPS2_OUT  (1 unrouted)
  Top 0.61: U$4.13 U$4.14 78.06,22.06 78.81,22.8 C87.1
IPS2_P  (3 unrouted)
  Top 0.61: 43.19,34.74 R59.2 | R51.2 47.46,34.63 48.2,35.37 48.73,35.37 48.76,35.39
IPS2_SH  (1 unrouted)
  Top 0.61: U$1.7 70.49,33.61 69.73,32.84 69.73,30.5 R11.2
IPS3_AD  (2 unrouted)
IPS3_FILTER
  Top 0.61: 81.38,15.83 U$4.10 | 81.38,15.83 C78.1 | R2.2 81.8,15.41 81.38,15.83
IPS3_N  (6 unrouted)
  Top 0.61: R58.1 47.13,23.49 48.17,22.45 48.88,22.45
IPS3_OUT  (1 unrouted)
  Top 0.61: C77.1 78.78,11.95 78.06,12.66 U$4.8 U$4.9
IPS3_P  (2 unrouted)
  Top 0.254: U$30.3 48.66,21.18 48.44,20.97
  Top 0.61: 48.02,20.55 48.12,20.65 | 48.12,20.65 48.44,20.97 48.6,21.13 | 42.91,20.55 R50.2 | R58.2 48.12,20.65
IPS3_SH  (1 unrouted)
  Top 0.61: U$1.14 81.22,41.23 R12.1 | R1.1 89.67,14.13 90.26,13.55
N$2
  Top 0.61: U$5.P 81.69,61.5 80.2,61.5 79.56,60.86 LP3992.4
N$3  (1 unrouted)
  Top 0.61: U$1.2 70.74,39.96 69.47,41.23 67.44,41.23 | 67.44,41.23 65.41,41.23 | R6.1 68.4,42.18 67.44,41.23
N$4  (2 unrouted)
  Top 0.61: R5.2 70.11,39.07 70.49,38.69 72.27,38.69
N$5  (1 unrouted)
  Top 0.61: R18.1 65.49,90.91 64.87,90.29 R16.2 66.33,88.19 66.96,87.56 71.54,87.56
N$6
  Top 0.61: R10.2 R11.1 67.69,30.37 67.69,32.59 69.98,34.88 U$1.6
N$7  (1 unrouted)
  Top 0.61: 72.01,36.15 71.76,35.89 68.97,35.89 67.82,34.75 R8.2 R9.2
N$8  (1 unrouted)
  Top 0.61: 71.3,86.3 65.39,86.3 R17.2 R19.2
N$9
  Top 0.61: R1.2 83.73,14.13 R2.1 83.7,11.97 C77.2
N$10
  Top 0.61: R3.2 85.4,101.74 R53.1 83.1,99.59 C81.2
N$11
  Top 0.61: R68.2 67.67,20.2 R69.1 67.68,22.32 C83.2
N$12
  Top 0.61: LED3.A R27.1
N$14
  Top 0.61: LED1.A 101.5,74.74 100.52,75.72 100.52,78.26 101.21,78.96 R28.1
N$15
  Top 0.61: R72.2 83.77,20.67 R73.1 C87.2
N$16  (1 unrouted)
  Top 0.61: 71.66,83.75 67.98,83.75 67.73,83.5 67.73,81.97 67.22,81.46 65.4,81.46 R20.2 64.94,80.9 R23.2
N$17  (2 unrouted)
N$19
  Top 0.61: R78.2 R79.1 67.23,101.97 C93.2
N$20
  Top 0.61: U$1.13 R13.1 87,40.02 87,41.48 86.49,41.99 R12.2
N$21  (2 unrouted)
N$22  (1 unrouted)
  Top 0.61: R24.2 R25.1 68.02,80.74 68.74,81.46 68.74,81.97 69.25,82.48 71.79,82.48
N$23  (3 unrouted)
  Top 0.61: 84.49,87.56 77.89,87.56
N$24  (1 unrouted)
  Top 0.61: 77.89,86.3 83.18,86.3 83.45,86.03 83.47,86.03 83.98,85.53 83.98,84.51 84.49,84 R30.1 R31.1
VPS1_AD  (2 unrouted)
VPS1_FILTER  (1 unrouted)
  Top 0.61: 71.71,102.38 71.71,102.39 71.7,102.4 69.93,102.4 69.54,102.01 R79.2 69.1,102.02 C94.1
VPS1_N  (1 unrouted)
  Top 0.61: VPS1.2 VPS1.3 VPS1.4 VPS1.5 38.03,98.74 R49.1 R57.1 45.95,98.79 46.94,97.8 47.63,97.8
VPS1_OUT  (1 unrouted)
  Top 0.61: 72.24,99.86 C93.1 | 72.24,99.86 U$6.7 | U$6.6 72.26,99.87 72.24,99.86
VPS1_P  (3 unrouted)
  Top 0.61: VPS1.1 42.24,96.61 | 42.24,96.61 47.83,96.61 | 42.24,96.61 43.26,95.59 45.29,95.59 45.8,96.1
VPS1_SH  (2 unrouted)
  Top 0.61: R18.2 71.48,90.91 71.79,90.61 71.79,89.08 | 63.21,102.18 63.13,102.1 | 63.13,102.1 R78.1 | 63.09,102.14 63.13,102.1
VPS2_AD  (2 unrouted)
VPS2_FILTER  (1 unrouted)
  Top 0.61: 77.82,104.93 79.94,104.93 C90.1 R75.2
VPS2_N  (1 unrouted)
  Top 0.61: VPS2.2 VPS2.3 VPS2.4 VPS2.5 R22.1 R56.1 46.71,84.25 47.86,84.22
VPS2_OUT  (2 unrouted)
  Top 0.61: U$6.14 U$6.13
VPS2_P  (3 unrouted)
  Top 0.61: U$29.3 42.85,82.9 35.09,83.16
VPS2_SH  (2 unrouted)
  Top 0.61: R25.2 69.92,80.48 70.61,81.17 71.73,81.17 71.78,81.22 71.78,81.21 71.77,81.2
VPS3_AD  (2 unrouted)
VPS3_FILTER  (1 unrouted)
  Top 0.61: 77.82,102.39 79.72,102.39 80.37,101.74 R53.2 81.19,101.75 C82.1
VPS3_N  (2 unrouted)
  Top 0.61: U$31.2 47.22,69.61 46.72,70.62 46.46,71.05 R55.1 R21.1 VPS3.5 VPS3.4 32.58,66.4 37.66,66.4
VPS3_OUT  (3 unrouted)
VPS3_P  (1 unrouted)
  Top 0.61: VPS3.1 41.71,68.33 R21.2 R55.2 47.78,68.39
VPS3_SH  (2 unrouted)
  Top 0.61: R26.1 83.28,90.92 82.97,90.61 82.97,89.59 82.19,88.82 77.7,88.82

### Text on the board
Top: Adapter Board V1 / 11.02.2020 / zya-tch